# EAGLE design midi-vidi (EAGLE 6.6.0)
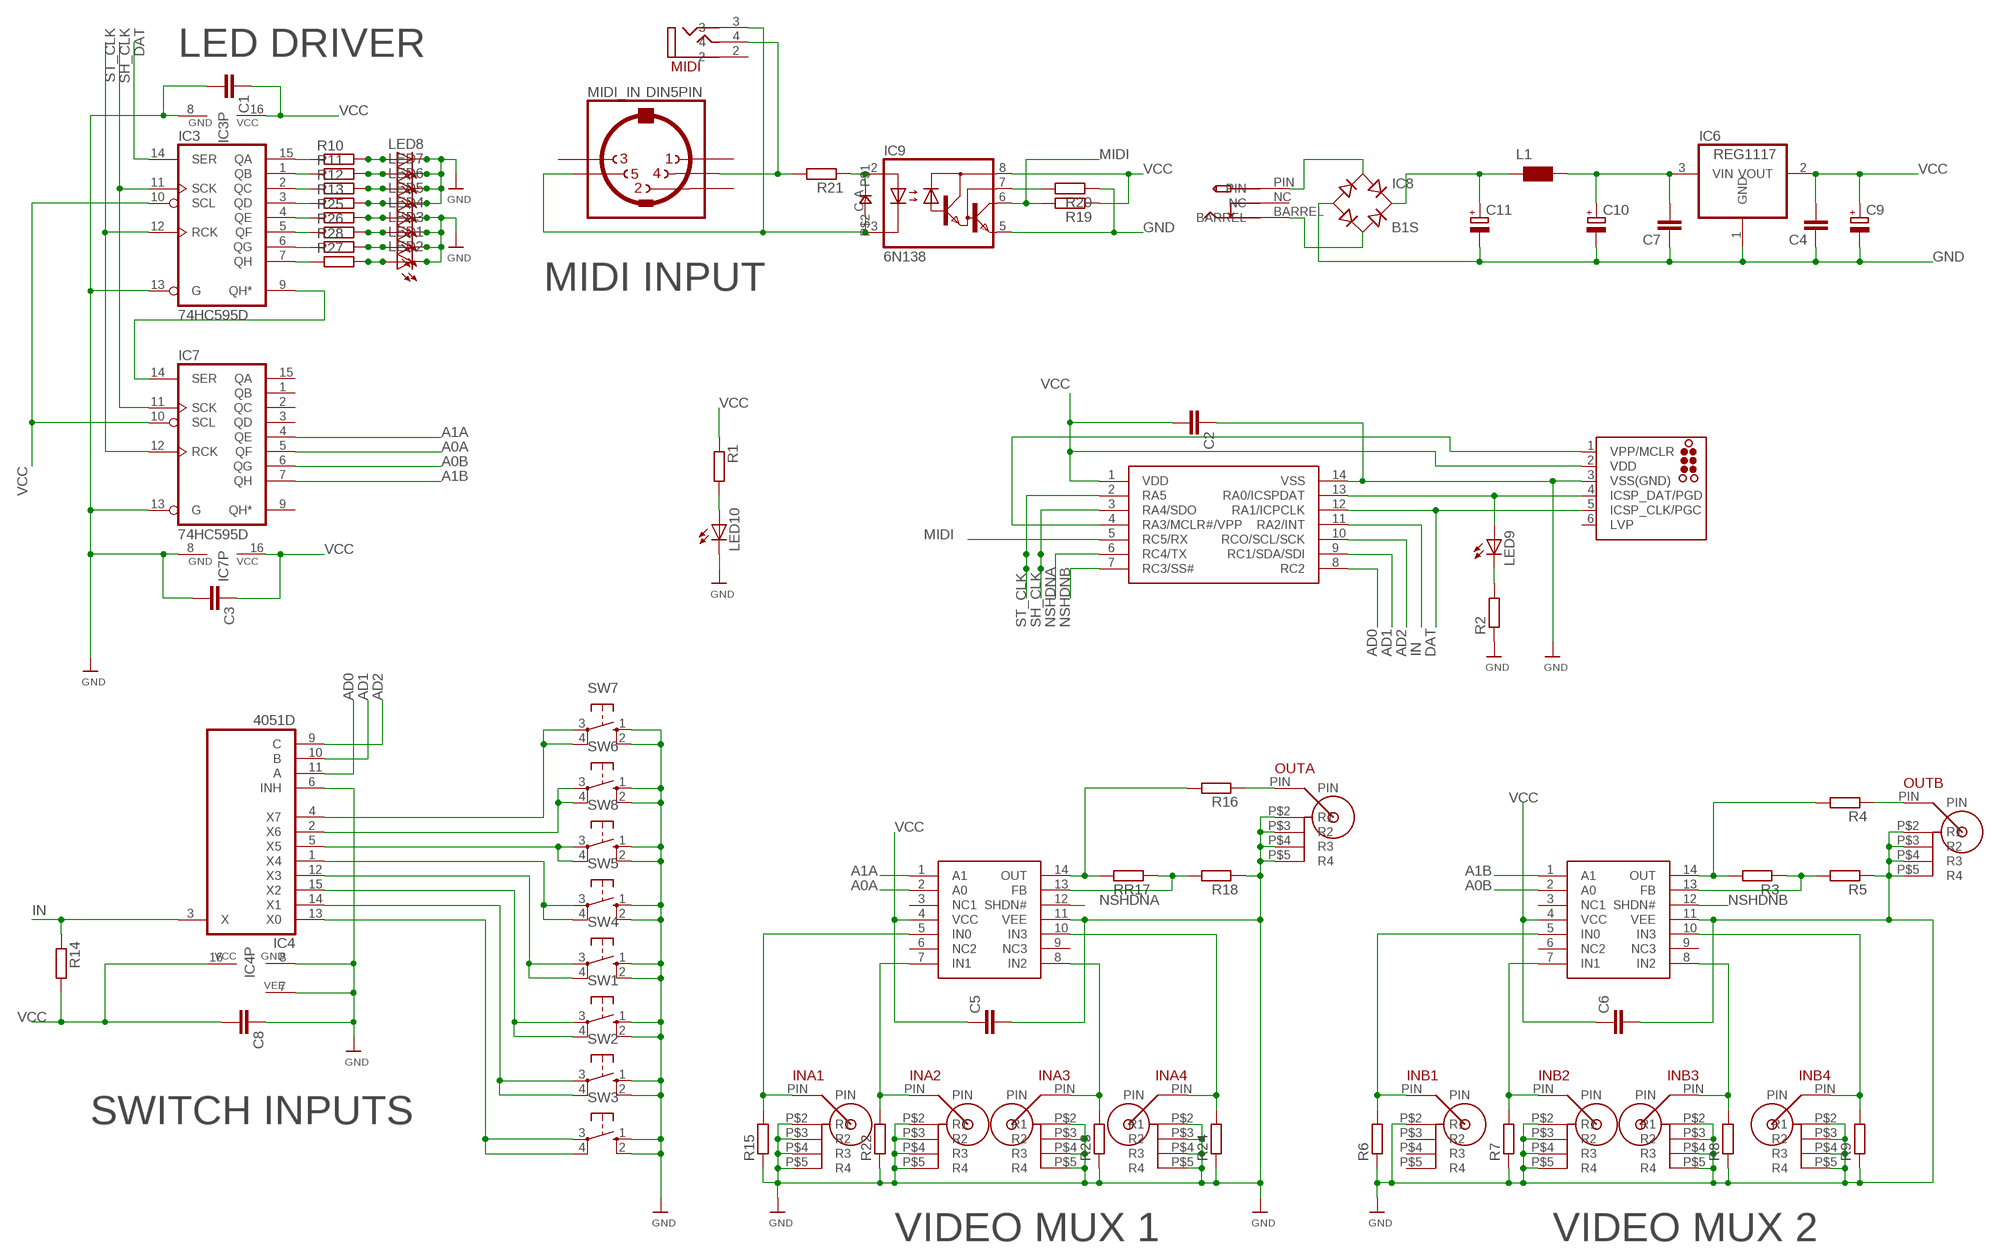
[diagram p0: schematic, sheet 1]

## Parts
C1  C-EUC0805  [C0805]
C2  C-EUC0805  [C0805]
C3  C-EUC0805  [C0805]
C4  C-EUC0805  [C0805]
C5  C-EUC0805  [C0805]
C6  C-EUC0805  [C0805]
C7  C-EUC0805  [C0805]
C8  C-EUC0805  [C0805]
C9  CPOL-EUE2,5-6E  [E2,5-6E]
C10  CPOL-EUE2,5-6E  [E2,5-6E]
C11  CPOL-EUE2,5-6E  [E2,5-6E]
D1  0805DIODE  [0805DIODE]
IC1  MAX4311SO14  [SO14]
IC2  PIC16F1825SO14  [SO14]
IC3  74HC595D  [SO16]
IC4  4051D  [SO16]
IC5  MAX4311SO14  [SO14]
IC6  REG1117  [SOT223]
IC7  74HC595D  [SO16]
IC8  B1S  [MBS]
IC9  6N138  [DIL08]
ICSP  TC2030-MCP-NL  [TC2030-MCP-NL]
INA1  RCAVERT  [RCAVERT]
INA2  RCAVERT  [RCAVERT]
INA3  RCAVERT  [RCAVERT]
INA4  RCAVERT  [RCAVERT]
INB1  RCAVERT  [RCAVERT]
INB2  RCAVERT  [RCAVERT]
INB3  RCAVERT  [RCAVERT]
INB4  RCAVERT  [RCAVERT]
L1  WE-TI_L  [WE-TI_L]
LED1  LED3MM  [LED3MM]
LED2  LED3MM  [LED3MM]
LED3  LED3MM  [LED3MM]
LED4  LED3MM  [LED3MM]
LED5  LED3MM  [LED3MM]
LED6  LED3MM  [LED3MM]
LED7  LED3MM  [LED3MM]
LED8  LED3MM  [LED3MM]
LED9  LED3MM  [LED3MM]
LED10  LED3MM  [LED3MM]
MIDI  VERTICAL_3_5MM_SOCKET  [VERTICAL_3_5MM_SOCKET]
MIDI_IN  DIN5PIN  [EDGEDIN]
OUTA  RCAVERT  [RCAVERT]
OUTB  RCAVERT  [RCAVERT]
R1  R-EU_R0805  [R0805]
R2  R-EU_R0805  [R0805]
R3  R-EU_R0805  [R0805]
R4  R-EU_R0805  [R0805]
R5  R-EU_R0805  [R0805]
R6  R-EU_R0805  [R0805]
R7  R-EU_R0805  [R0805]
R8  R-EU_R0805  [R0805]
R9  R-EU_R0805  [R0805]
R10  R-EU_R0805  [R0805]
R11  R-EU_R0805  [R0805]
R12  R-EU_R0805  [R0805]
R13  R-EU_R0805  [R0805]
R14  R-EU_R0805  [R0805]
R15  R-EU_R0805  [R0805]
R16  R-EU_R0805  [R0805]
R18  R-EU_R0805  [R0805]
R19  R-EU_R0805  [R0805]
R20  R-EU_R0805  [R0805]
R21  R-EU_R0805  [R0805]
R22  R-EU_R0805  [R0805]
R23  R-EU_R0805  [R0805]
R24  R-EU_R0805  [R0805]
R25  R-EU_R0805  [R0805]
R26  R-EU_R0805  [R0805]
R27  R-EU_R0805  [R0805]
R28  R-EU_R0805  [R0805]
RR17  R-EU_R0805  [R0805]
SW1  10-XX  [B3F-10XX]
SW2  10-XX  [B3F-10XX]
SW3  10-XX  [B3F-10XX]
SW4  10-XX  [B3F-10XX]
SW5  10-XX  [B3F-10XX]
SW6  10-XX  [B3F-10XX]
SW7  10-XX  [B3F-10XX]
SW8  10-XX  [B3F-10XX]
U$2  PWR_SOCKET_2_1MM  [PWR_SOCKET_2_1MM]

## Nets
A0A: IC5.2(A0) IC7.5(QF)
A0B: IC1.2(A0) IC7.6(QG)
A1A: IC5.1(A1) IC7.4(QE)
A1B: IC1.1(A1) IC7.7(QH)
AD0: IC2.8(RC2) IC4.11(A)
AD1: IC2.9(RC1/SDA/SDI) IC4.10(B)
AD2: IC2.10(RCO/SCL/SCK) IC4.9(C)
DAT: IC2.12(RA1/ICPCLK) IC3.14(SER) ICSP.5(ICSP_CLK/PGC)
GND: C1.2 C2.1 C3.2 C4.1 C5.2 C6.2 C7.1 C8.1 C9.- C10.- C11.- IC1.11(VEE) IC2.14(VSS) IC3.8(GND) IC3.13(G) IC4.6(INH) IC4.7(VEE) IC4.8(GND) IC5.11(VEE) IC6.1(GND) IC7.8(GND) IC7.13(G) IC8.- IC9.5(GND) ICSP.3(VSS(GND)) INA1.P$2(R1) INA1.P$3(R2) INA1.P$4(R3) INA1.P$5(R4) INA2.P$2(R1) INA2.P$3(R2) INA2.P$4(R3) INA2.P$5(R4) INA3.P$2(R1) INA3.P$3(R2) INA3.P$4(R3) INA3.P$5(R4) INA4.P$2(R1) INA4.P$3(R2) INA4.P$4(R3) INA4.P$5(R4) INB1.P$2(R1) INB2.P$2(R1) INB2.P$3(R2) INB2.P$4(R3) INB2.P$5(R4) INB3.P$2(R1) INB3.P$3(R2) INB3.P$4(R3) INB3.P$5(R4) INB4.P$2(R1) INB4.P$3(R2) INB4.P$4(R3) INB4.P$5(R4) LED1.K(C) LED2.K(C) LED3.K(C) LED4.K(C) LED5.K(C) LED6.K(C) LED7.K(C) LED8.K(C) LED10.K(C) OUTA.P$2(R1) OUTA.P$3(R2) OUTA.P$4(R3) OUTA.P$5(R4) OUTB.P$2(R1) OUTB.P$3(R2) OUTB.P$4(R3) OUTB.P$5(R4) R2.1 R5.1 R6.1 R7.1 R8.1 R9.1 R15.1 R18.1 R20.1 R22.1 R23.1 R24.1 SW1.1(S) SW1.2(S1) SW2.1(S) SW2.2(S1) SW3.1(S) SW3.2(S1) SW4.1(S) SW4.2(S1) SW5.1(S) SW5.2(S1) SW6.1(S) SW6.2(S1) SW7.1(S) SW7.2(S1) SW8.1(S) SW8.2(S1)
IN: IC2.11(RA2/INT) IC4.3(X) R14.1
MIDI: IC2.5(RC5/RX) IC9.6(VO) R19.2
N$1: IC5.10(IN3) INA4.PIN R24.2
N$2: IC5.8(IN2) INA3.PIN R23.2
N$3: IC5.7(IN1) INA2.PIN R22.2
N$4: IC5.5(IN0) INA1.PIN R15.2
N$5: IC5.14(OUT) R16.2 RR17.2
N$6: IC5.13(FB) R18.2 RR17.1
N$7: OUTA.PIN R16.1
N$8: D1.A IC9.2(A) R21.1
N$9: MIDI.4 MIDI_IN.4 R21.2
N$10: IC1.7(IN1) INB2.PIN R7.2
N$11: IC1.8(IN2) INB3.PIN R8.2
N$12: IC1.5(IN0) INB1.PIN R6.2
N$13: IC1.14(OUT) R3.2 R4.2
N$14: IC1.13(FB) R3.1 R5.2
N$15: C7.2 C10.+ IC6.3(VIN) L1.1
N$16: OUTB.PIN R4.1
N$17: IC1.10(IN3) INB4.PIN R9.2
N$18: D1.C IC9.3(C) MIDI.3 MIDI_IN.5
N$19: LED8.A R10.2
N$20: LED7.A R11.2
N$21: LED6.A R12.2
N$22: IC9.7(VB) R20.2
N$23: IC3.15(QA) R10.1
N$24: LED5.A R13.2
N$25: IC3.1(QB) R11.1
N$26: IC3.2(QC) R12.1
N$27: IC3.3(QD) R13.1
N$28: IC3.4(QE) R25.1
N$29: IC3.5(QF) R26.1
N$30: IC3.6(QG) R28.1
N$31: IC3.7(QH) R27.1
N$32: LED4.A R25.2
N$33: LED3.A R26.2
N$34: LED1.A R28.2
N$35: LED2.A R27.2
N$36: LED9.K(C) R2.2
N$37: IC4.4(X7) SW7.3(P) SW7.4(P1)
N$38: IC4.2(X6) SW6.3(P) SW6.4(P1)
N$39: IC4.5(X5) SW8.3(P) SW8.4(P1)
N$40: IC4.1(X4) SW5.3(P) SW5.4(P1)
N$41: IC4.12(X3) SW4.3(P) SW4.4(P1)
N$42: IC4.15(X2) SW1.3(P) SW1.4(P1)
N$43: IC4.14(X1) SW2.3(P) SW2.4(P1)
N$44: IC4.13(X0) SW3.3(P) SW3.4(P1)
N$45: IC2.13(RA0/ICSPDAT) ICSP.4(ICSP_DAT/PGD) LED9.A
N$46: IC8.AC1 U$2.PIN
N$47: IC3.9(QH*) IC7.14(SER)
N$48: IC2.4(RA3/MCLR#/VPP) ICSP.1(VPP/MCLR)
N$49: IC8.AC2 U$2.BARREL
N$50: LED10.A R1.2
N$51: C11.+ IC8.+ L1.2
NSHDNA: IC2.6(RC4/TX) IC5.12(SHDN#)
NSHDNB: IC1.12(SHDN#) IC2.7(RC3/SS#)
SH_CLK: IC2.3(RA4/SDO) IC3.11(SCK) IC7.11(SCK)
ST_CLK: IC2.2(RA5) IC3.12(RCK) IC7.12(RCK)
VCC: C1.1 C2.2 C3.1 C4.2 C5.1 C6.1 C8.2 C9.+ IC1.4(VCC) IC2.1(VDD) IC3.10(SCL) IC3.16(VCC) IC4.16(VCC) IC5.4(VCC) IC6.2(VOUT) IC7.10(SCL) IC7.16(VCC) IC9.8(VCC) ICSP.2(VDD) R1.1 R14.2 R19.1
Unconnected: IC1.3(NC1) IC1.6(NC2) IC1.9(NC3) IC5.3(NC1) IC5.6(NC2) IC5.9(NC3) IC7.1(QB) IC7.2(QC) IC7.3(QD) IC7.9(QH*) IC7.15(QA) ICSP.6(LVP) INB1.P$3(R2) INB1.P$4(R3) INB1.P$5(R4) MIDI.2 MIDI_IN.1 MIDI_IN.2 MIDI_IN.3 U$2.NC

## Notes on the sheet
- LED DRIVER
- MIDI INPUT
- SWITCH INPUTS
- VIDEO MUX 1 | VIDEO MUX 2

## Library data of the parts
C1-C8 = rcl:C-EU: CAPACITOR, European symbol
C9-C11 = rcl:CPOL-EU: POLARIZED CAPACITOR, European symbol
D1 = jasons_stuff:0805DIODE
IC1 IC5 = jason_eagle6:MAX4311
IC2 = jasons_stuff:PIC16F1825
IC3 IC7 = 74xx-eu:74*595: 8-bit SHIFT REGISTER, output latch
IC4 = 40xx:4051: 8-channel ANALOG MULTIPLEXER
IC6 = burr-brown:REG1117: 800mA and 1A Low Dropout (LDO) Positive Regulator 1.8V, 2.5V, 2.85V, 3.3V, 5V, and Adj; MPN: REG1117; OC_FARNELL: 1097566; OC_NEWARK: 14P6981
IC8 = rectifier:B*S: Surface Mount Glass Passivated Bridge Rectifiers Source: Comchip Bridge Rectifiers B05S-G_B10S-G.pdf
IC9 = optocoupler:6N138: MOTOROLA OPTO COUPLER; MF: VISHAY/TELEFUNKEN; MPN: 6N138; OC_FARNELL: 9860150; OC_NEWARK: 35K5294
ICSP = tag-connect:TC2030: TAG-CONNECT ICSP Connector Manufacturer: Tag-Connect <http://www.tag-connect.com> Cable for easy In-Circuit Serial Programming. Designed for Microchip ICD2, suitable for many others. Two variants - one "with legs" (for hands-free fit on PCB) and another "without legs" for quick programming. PAD Description 1 MCLR/Vpp 2 Vdd 3 GND 4 PGD (ISPDAT) 5 PGC (ISPCLK) 6 nc (used for LVP) ©2009 ROFA.cz - modified and updated by Robert Darlington ‹rdarlington@gmail.com›
INA1-INA4 INB1-INB4 OUTA OUTB = jason_eagle6:RCAVERT
L1 = wuerth-elektronik:WE-TI: Radial Leaded Wire Wound Inductor WE-TI A low-cost storage/filtering possibility in comparison to SMD versions - Radial through-hole inductor - High saturation core material -- Signal filtering -- NF-switches
LED1-LED10 = led:LED: LED OSRAM: - CHIPLED LG R971, LG N971, LY N971, LG Q971, LY Q971, LO R971, LY R971 LH N974, LH R974 LS Q976, LO Q976, LY Q976 LO Q996 - Hyper CHIPLED LW Q18S LB Q993, LB Q99A, LB R99A - SideLED LS A670, LO A670, LY A670, LG A670, LP A670 LB A673, LV A673, LT A673, LW A673 LH A674 LY A675 LS A676, LA A676, LO A676, LY A676, LW A676 LS A679, LY A679, LG A679 - Hyper Micro SIDELED® LS Y876, LA Y876, LO Y876, LY Y876 LT Y87S - SmartLED LW L88C, LW L88S LB L89C, LB L89S, LG L890 LS L89K, LO L89K, LY L89K LS L896, LA L896, LO L896, LY L896 - TOPLED LS T670, LO T670, LY T670, LG T670, LP T670 LSG T670, LSP T670, LSY T670, LOP T670, LYG T670 LG T671, LOG T671, LSG T671 LB T673, LV T673, LT T673, LW T673 LH T674 LS T676, LA T676, LO T676, LY T676, LB T676, LH T676, LSB T676, LW T676 LB T67C, LV T67C, LT T67C, LS T67K, LO T67K, LY T67K, LW E67C LS E67B, LA E67B, LO E67B, LY E67B, LB E67C, LV E67C, LT E67C LW T67C LS T679, LY T679, LG T679 LS T770, LO T770, LY T770, LG T770, LP T770 LB T773, LV T773, LT T773, LW T773 LH T774 LS E675, LA E675, LY E675, LS T675 LS T776, LA T776, LO T776, LY T776, LB T776 LHGB T686 LT T68C, LB T68C - Hyper Mini TOPLED® LB M676 - Mini TOPLED Santana® LG M470 LS M47K, LO M47K, LY M47K Source: http://www.osram.convergy.de LUXEON: - LUMILED® LXK2-PW12-R00, LXK2-PW12-S00, LXK2-PW14-U00, LXK2-PW14-V00 LXK2-PM12-R00, LXK2-PM12-S00, LXK2-PM14-U00 LXK2-PE12-Q00, LXK2-PE12-R00, LXK2-PE12-S00, LXK2-PE14-T00, LXK2-PE14-U00 LXK2-PB12-K00, LXK2-PB12-L00, LXK2-PB12-M00, LXK2-PB14-N00, LXK2-PB14-P00, LXK2-PB14-Q00 LXK2-PR12-L00, LXK2-PR12-M00, LXK2-PR14-Q00, LXK2-PR14-R00 LXK2-PD12-Q00, LXK2-PD12-R00, LXK2-PD12-S00 LXK2-PH12-R00, LXK2-PH12-S00 LXK2-PL12-P00, LXK2-PL12-Q00, LXK2-PL12-R00 Source: www.luxeon.com KINGBRIGHT: KA-3528ASYC Source: www.kingbright.com
MIDI = jason_eagle6:VERTICAL_3_5MM_SOCKET
MIDI_IN = jason_eagle6:DIN5PIN: Female CONNECTOR 5 pins 90 deg. with shield, horizontal (DIN 41524)
R1-R16 R18-R28 RR17 = rcl:R-EU_: RESISTOR, European symbol
SW1-SW8 = switch-omron:10-XX: OMRON SWITCH; MPN: B3F-1000; OC_FARNELL: 176432; OC_NEWARK: 36M3542
U$2 = jason_eagle6:PWR_SOCKET_2_1MM

## Board
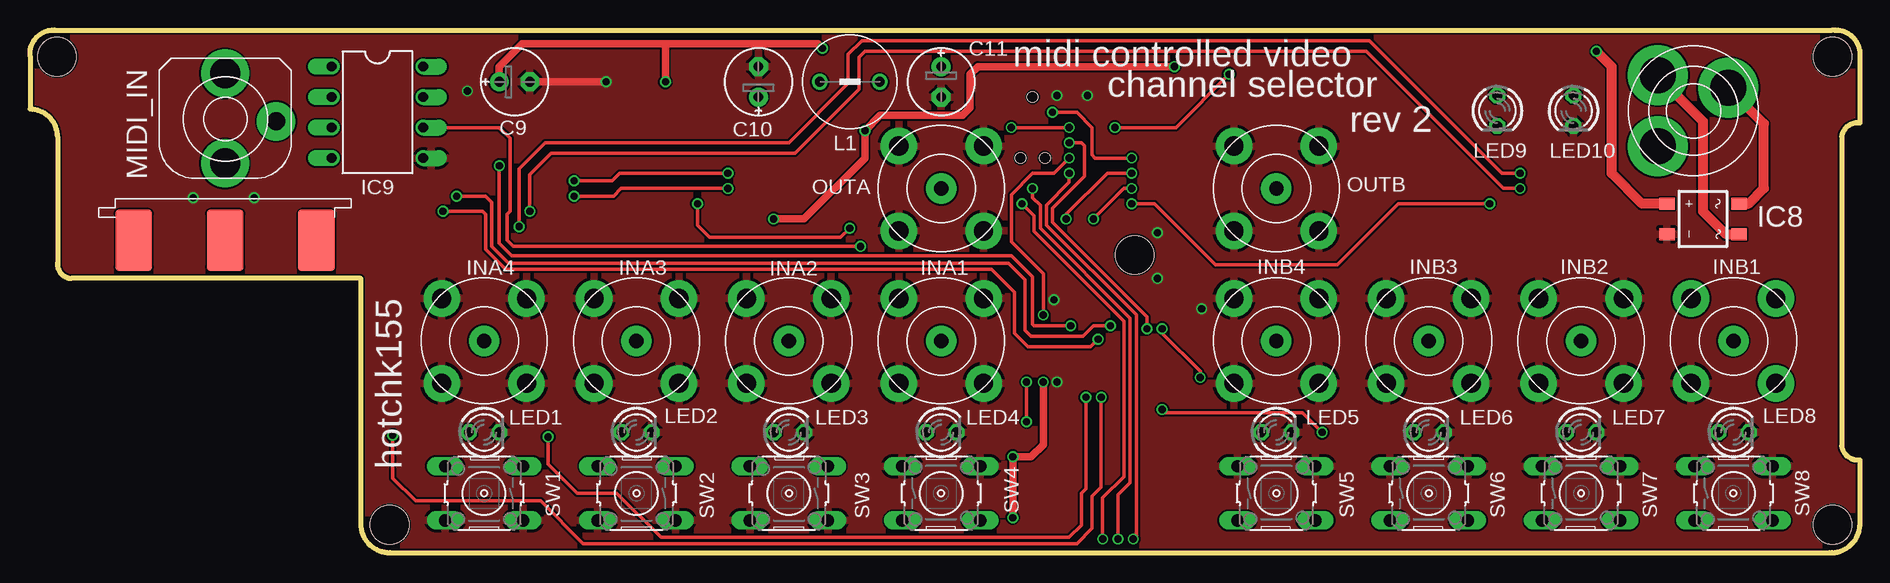
[diagram p1: board, top side]
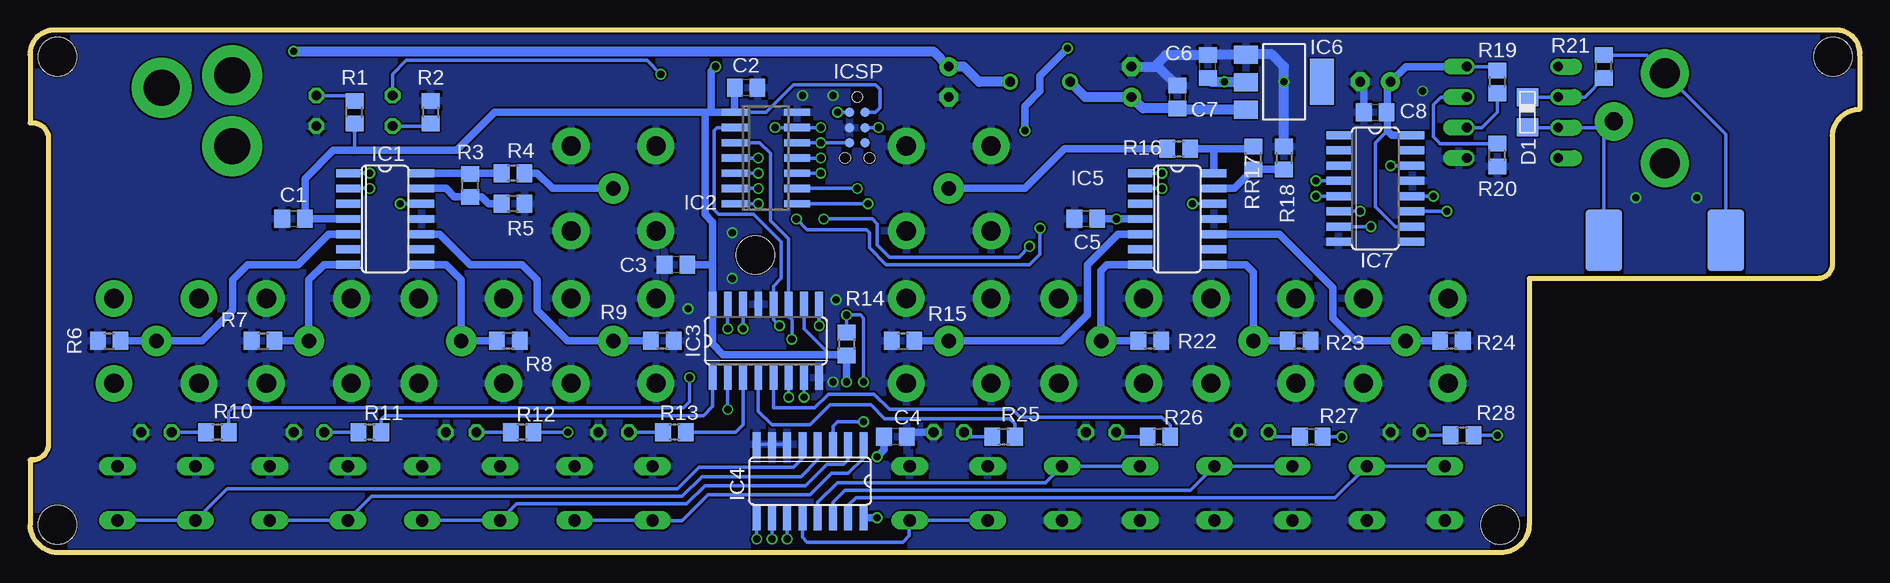
[diagram p2: board, bottom side, seen from below]

Size 152.53 x 43.56 mm. Coordinates in mm from the lower left corner, seen from the top.
Outline: 150.25,43.56 2.04,43.56 arc97 0.01,41.4 0.01,36.96 arc-90 2.29,34.67 2.29,24.13 arc90 3.44,22.86 27.57,22.86 27.57,2.41 arc90 29.98,0 149.99,0 arc90 152.53,2.29 152.53,7.75 arc-90 151.01,8.89 151.01,34.67 arc-90 152.53,35.82 152.53,41.53 arc90 150.5,43.56 150.38,43.56
Copper layers (1*16): Top 0.035mm / dielectric 1.5mm / Bottom 0.035mm
Design rules "hackvana": minimum track width 6mil, minimum drill 0.3mm, track to track 6mil, track to pad 9mil, pad to pad 6mil, via to via 6mil, smd to smd 0mil, copper to edge 6mil, drill to drill 6mil, minimum pad ring 10mil, minimum via ring 6mil, stop-mask expansion 2mil, vias tented up to drill 100mil, thermal gap 10mil
Holes 3.2 mm at 29.98,2.33 150.26,2.33 2.26,41.33 150.26,41.33 92.08,24.82

### Footprints (pad centres in the part's own frame; a part is rotated, then mirrored left to right if it is on the bottom)
C0805 = smd 1.3 x 1.5: 1 -0.95,0; 2 0.95,0
E2,5-6E = drill 0.813 pad 1.575: + -1.27,0 | drill 0.813 pad 1.575 octagon: - 1.27,0
0805DIODE = smd 1.524 x 1.778: A -1.262,-0.005; C 1.238,-0.005
SO14 = smd 0.66 x 2.032: 1 -3.81,-3.073; 2 -2.54,-3.073; 3 -1.27,-3.073; 4 0,-3.073; 5 1.27,-3.073; 6 2.54,-3.073; 7 3.81,-3.073; 8 3.81,3.073; 9 2.54,3.073; 10 1.27,3.073; 11 0,3.073; 12 -1.27,3.073; 13 -2.54,3.073; 14 -3.81,3.073
SO14' = smd 0.6 x 2.2: 1 -3.81,-2.6; 2 -2.54,-2.6; 3 -1.27,-2.6; 4 0,-2.6; 5 1.27,-2.6; 6 2.54,-2.6; 7 3.81,-2.6; 8 3.81,2.6; 9 2.54,2.6; 10 1.27,2.6; 11 0,2.6; 12 -1.27,2.6; 13 -2.54,2.6; 14 -3.81,2.6
SO16 = smd 0.66 x 2.032: 1 -4.445,-3.073; 2 -3.175,-3.073; 3 -1.905,-3.073; 4 -0.635,-3.073; 5 0.635,-3.073; 6 1.905,-3.073; 7 3.175,-3.073; 8 4.445,-3.073; 9 4.445,3.073; 10 3.175,3.073; 11 1.905,3.073; 12 0.635,3.073; 13 -0.635,3.073; 14 -1.905,3.073; 15 -3.175,3.073; 16 -4.445,3.073
SOT223 = smd 1.499 x 2.007: 1 -2.261,-3.15; 2 0.025,-3.15; 3 2.311,-3.15 | smd 3.81 x 2.007: 4 0,3.15
MBS = smd 1 x 1.3: + -1.27,-3; - 1.27,-3; AC1 -1.27,3; AC2 1.27,3
DIL08 = drill 0.813 offset: 1 -3.81,-3.81; 2 -1.27,-3.81; 3 1.27,-3.81; 4 3.81,-3.81; 5 3.81,3.81; 6 1.27,3.81; 7 -1.27,3.81; 8 -3.81,3.81
TC2030-MCP-NL = smd 0.787 x 0.787: 1 1.27,-0.635; 2 1.27,0.635; 3 2.54,-0.635; 4 2.54,0.635; 5 3.81,-0.635; 6 3.81,0.635 | hole 0.889: 0,0; 5.08,-1.016; 5.08,1.016
RCAVERT = drill 1.6 pad 3.048: P$2 -5,0; P$3 5,0; P$4 0,5; P$5 0,-5 | drill 1.2 pad 2.54: PIN 0,0
WE-TI_L = drill 0.813: 1 -2.5,0; 2 2.5,0
LED3MM = drill 0.813 octagon: A -1.27,0; K 1.27,0
VERTICAL_3_5MM_SOCKET = drill 2.5 pad 4: 2 0,-3.75; 4 0,3.75 | drill 1.5 pad 3.2: 3 4.25,-0.25
EDGEDIN = smd 3.048 x 5.08: 1 -7.62,-10.16; 2 0,-10.16; 3 7.62,-10.16 | smd 3.048 x 5.08 bottom: 4 -5.08,-10.16; 5 5.08,-10.16
R0805 = smd 1.3 x 1.5: 1 -0.95,0; 2 0.95,0
B3F-10XX = drill 1.016 long: 1 -3.251,2.261; 2 3.251,2.261; 3 -3.251,-2.261; 4 3.251,-2.261
PWR_SOCKET_2_1MM = drill 3 pad 5: BARREL 0,4.2; NC -4.2,0; PIN 3.4,-0.7

### Placement (x,y rotation side)
C1  130.56,27.81 180 bottom
C2  92.84,38.74 180 bottom
C3  98.69,24 180 bottom
C4  80.4,9.65 180 bottom
C5  64.52,27.81 180 bottom
C6  54.36,40.51 90 bottom
C7  56.9,37.97 270 bottom
C8  40.39,36.7 0 bottom
C9  40.39,39.24 0 top
C10  60.71,39.24 90 top
C11  75.95,39.24 270 top
D1  27.69,36.7 270 bottom
IC1  122.94,27.81 270 bottom
IC2  PIC16F1825SO14  [SO14']  91.19,32.89 270 bottom
IC3  91.19,17.65 0 bottom
IC4  87.51,5.97 180 bottom
IC5  56.9,27.81 270 bottom
IC6  48.01,39.24 270 bottom
IC7  40.39,30.35 270 bottom
IC8  139.45,27.81 270 top
IC9  28.96,36.7 270 top
ICSP  83.57,37.97 270 bottom
INA1  75.95,17.65 45 top
INA2  63.25,17.65 45 top
INA3  50.55,17.65 45 top
INA4  37.85,17.65 45 top
INB1  141.99,17.65 45 top
INB2  129.29,17.65 45 top
INB3  116.59,17.65 45 top
INB4  103.89,17.65 45 top
L1  68.33,39.24 0 top
LED1  37.85,10.03 0 top
LED2  50.55,10.03 0 top
LED3  63.25,10.03 0 top
LED4  75.95,10.03 0 top
LED5  103.89,10.03 0 top
LED6  116.59,10.03 0 top
LED7  129.29,10.03 0 top
LED8  141.99,10.03 0 top
LED9  122.31,36.83 270 top
LED10  128.66,36.83 270 top
MIDI  16.26,36.2 0 top
MIDI_IN  16.26,36.2 0 top
OUTA  75.95,30.35 45 top
OUTB  103.89,30.35 45 top
R1  125.48,36.7 90 bottom
R2  119.13,36.7 270 bottom
R3  115.83,30.61 90 bottom
R4  112.28,31.62 180 bottom
R5  112.28,29.08 180 bottom
R6  145.93,17.65 0 bottom
R7  133.1,17.65 0 bottom
R8  112.66,17.65 180 bottom
R9  99.83,17.65 180 bottom
R10  136.91,10.03 180 bottom
R11  124.21,10.03 180 bottom
R12  111.51,10.03 180 bottom
R13  98.81,10.03 180 bottom
R14  84.46,17.4 270 bottom
R15  79.76,17.65 0 bottom
R16  56.78,33.66 0 bottom
R18  48.01,32.89 270 bottom
R19  30.23,39.24 270 bottom
R20  30.23,33.15 90 bottom
R21  21.34,40.51 90 bottom
R22  59.19,17.65 180 bottom
R23  46.74,17.65 180 bottom
R24  34.04,17.65 180 bottom
R25  71.38,9.65 180 bottom
R26  58.43,9.65 180 bottom
R27  45.73,9.65 180 bottom
R28  33.15,9.78 180 bottom
RR17  50.55,32.89 90 bottom
SW1  37.85,4.95 180 top
SW2  50.55,4.95 180 top
SW3  63.25,4.95 180 top
SW4  75.95,4.95 0 top
SW5  103.89,4.95 0 top
SW6  116.59,4.95 0 top
SW7  129.29,4.95 0 top
SW8  141.99,4.95 0 top
U$2  138.66,36.83 45 top

### Tracks (layer width: path | path; a pad name or v marks a point on that pad's centre or on a via)
A0A  (via drill 0.6)
  Top 0.305: v45.35,29.72 48.65,29.72 49.28,30.35 v58.17,30.35
  Bottom 0.305: IC7.5 v45.35,29.72 | v58.17,30.35 IC5.2
A0B  (via drill 0.6)
  Top 0.305: v124.21,30.35 122.82,30.35 111.39,41.78 69.6,41.78 69.1,41.28 69.1,38.61 63.76,33.28 43.44,33.28 41.66,31.5 v41.66,28.45
  Bottom 0.305: IC7.6 v41.66,28.45 | 126.75,30.35 IC1.2 v124.21,30.35
A1A  (via drill 0.6)
  Top 0.305: v45.35,30.99 48.52,30.99 49.16,31.62 v58.17,31.62
  Bottom 0.305: IC7.4 v45.35,30.99 | v58.17,31.62 IC5.1
A1B  (via drill 0.6)
  Top 0.305: v124.21,31.62 122.69,31.62 111.64,42.67 69.35,42.67 68.21,41.53 68.21,39.12 63.25,34.16 42.93,34.16 40.77,32.01 v40.77,27.18
  Bottom 0.305: IC1.1 v124.21,31.62 | v40.77,27.18 IC7.7
AD0  (via drill 0.6)
  Top 0.305: v89.42,1.14 89.42,4.57 91.19,6.35 91.19,19.31 83.7,26.8 83.7,28.07 v82.68,29.08
  Bottom 0.305: IC4.11 v89.42,1.14 | IC2.8 v82.68,29.08
AD1  (via drill 0.6)
  Top 0.305: v90.69,1.14 90.69,4.83 91.7,5.84 91.7,19.56 84.21,27.05 84.21,28.96 83.57,29.59 v83.57,30.35
  Bottom 0.305: IC4.10 v90.69,1.14 | IC2.9 v83.57,30.35
AD2  (via drill 0.6)
  Top 0.305: v86.62,31.62 86.62,30.86 84.72,28.96 84.72,27.31 92.21,19.81 92.21,1.4 v91.96,1.14
  Bottom 0.305: IC4.9 v91.96,1.14 | IC2.10 v86.62,31.62
DAT  (via drill 0.6)
  Top 0.305: v86.62,34.16 87.64,34.16 87.89,33.91 87.89,31.37 85.22,28.7 85.22,27.56 93.1,19.69 v93.1,18.67
  Bottom 0.305: ICSP.5 v86.62,34.16 IC2.12 | IC3.14 v93.1,18.67
GND  (via drill 0.6)
  Top 0.61: C9.- v48.01,39.24
  Bottom 0.305: IC4.8 IC4.7 IC4.6
  Bottom 0.61: LED4.K 79.07,10.03 C4.1 | C8.1 41.34,38.92 C9.-
  Bottom 0.813: C10.- 58.81,40.51 | 58.81,40.51 58.49,40.51 C7.1 | 58.81,40.51 57.86,41.46 C6.2 54.32,41.51 IC6.1 51.14,41.53 49.03,41.53 48.01,40.51 v48.01,39.24 R18.1
  other vias: 13.6,29.59 18.68,29.59 36.46,38.48 97.67,20.32 93.99,22.86 85.61,14.23 85.61,38.1 88.15,38.1 85.35,21.08 93.99,26.67
  pour Bottom: -4.06,45.59 -4.06,-2.67 157.23,-2.67 157.23,48.13 -4.06,48.13
  pour Top: -2.79,46.86 -2.79,-3.94 155.96,-3.94 155.96,48.13 -2.79,48.13
IN  (via drill 0.6)
  Top 0.305: v84.46,19.81 84.46,23.24 81.8,25.91 81.8,29.85 83.57,31.62 85.35,31.62 v86.62,32.89 | v83.07,10.92 v83.07,14.23
  Bottom 0.305: IC2.11 v86.62,32.89 | R14.1 v84.46,19.81 83.32,19.81 83.07,19.56 v83.07,14.23 | IC4.3 85.61,10.54 85.22,10.92 v83.07,10.92
MIDI  (via drill 0.6)
  Top 0.305: v91.83,31.62 89.8,31.62 86.37,28.2 v86.37,27.81 | IC9.6 39.12,35.43 40.01,34.55 40.01,28.45 39.76,28.2 39.76,26.04 40.27,25.53 v69.22,25.53
  Bottom 0.305: IC2.5 v91.83,31.62 | v69.22,25.53 70.11,24.64 80.91,24.64 81.92,25.66 81.92,27.43 82.3,27.81 v86.37,27.81 | IC9.6 31.5,35.43 30.23,36.7 R19.2
N$1
  Bottom 0.61: R24.2 INA4.PIN 42.04,17.65 43.95,19.56 43.95,22.1 48.39,26.54 IC5.10
N$2
  Bottom 0.61: IC5.8 51.19,24 50.55,23.37 INA3.PIN R23.2
N$3
  Bottom 0.61: IC5.7 62.75,24 63.25,23.5 INA2.PIN R22.2
N$4
  Bottom 0.61: R15.2 INA1.PIN 66.56,17.65 64.4,19.81 64.4,24 61.86,26.54 IC5.5
N$5
  Bottom 0.61: R16.2 53.86,33.66 | 53.86,33.66 50.74,33.66 RR17.2 | IC5.14 53.83,33.63 53.86,33.66
N$6
  Bottom 0.61: R18.2 RR17.1 52.14,30.35 IC5.13
N$7
  Bottom 0.61: R16.1 66.3,33.66 69.6,30.35 OUTA.PIN
N$8
  Bottom 0.305: R21.1 22.93,37.97 IC9.2 27.69,37.97 D1.A
N$9
  Bottom 0.305: MIDI_IN.4 11.18,34.87 MIDI.4 17.78,41.46 R21.2
N$10
  Bottom 0.61: IC1.7 128.02,24 129.29,22.73 INB2.PIN R7.2
N$11
  Bottom 0.61: IC1.8 117.86,24 116.59,22.73 INB3.PIN R8.2
N$12
  Bottom 0.61: IC1.5 127.64,26.54 130.18,24 134.37,24 135.64,22.73 135.64,20.19 138.18,17.65 INB1.PIN R6.2
N$13
  Bottom 0.61: IC1.14 115.9,31.62 R3.2 115.77,31.62 R4.2
N$14
  Bottom 0.61: IC1.13 117.86,30.35 117.17,29.66 R3.1 114.88,29.66 114.31,29.08 R5.2
N$15
  Bottom 0.813: L1.1 64.56,37.97 C10.+ 59.76,37.02 C7.2 56.81,36.93 IC6.3
N$16
  Bottom 0.61: OUTB.PIN 108.97,30.35 110.24,31.62 R4.1
N$17
  Bottom 0.61: IC1.10 118.37,26.54 115.83,24 111.51,24 110.24,22.73 110.24,20.19 107.7,17.65 INB4.PIN R9.2
N$18
  Bottom 0.305: D1.C 27.67,35.43 IC9.3 21.03,35.43 MIDI.3 21.34,35.12 MIDI_IN.5
N$19
  Bottom 0.305: R10.2 LED8.A
N$20
  Bottom 0.305: R11.2 LED7.A
N$21
  Bottom 0.305: R12.2 LED6.A
N$22
  Bottom 0.305: IC9.7 34.93,37.97 35.57,37.34 35.57,34.67 35.19,34.29 35.06,34.16 34.99,34.1 R20.2
N$23  (via drill 0.6)
  Top 0.305: v94.37,18.67 94.37,18.29 97.54,15.11 v97.54,14.61
  Bottom 0.305: R10.1 135.96,11.75 135.64,12.07 98.05,12.07 97.54,12.57 v97.54,14.61 | IC3.15 v94.37,18.67
N$24
  Bottom 0.305: R13.2 LED5.A
N$25
  Bottom 0.305: R11.1 123.26,11.11 122.94,11.43 98.81,11.43 97.8,11.43 96.4,11.43 95.64,12.19 IC3.1
N$26  (via drill 0.6)
  Top 0.305: v107.7,10.03 106.05,11.69 94.62,11.69 v94.37,11.94
  Bottom 0.305: R12.1 v107.7,10.03 | v94.37,11.94 IC3.2
N$27
  Bottom 0.305: IC3.3 93.1,10.67 93.73,10.03 R13.1
N$28
  Bottom 0.305: R25.1 70.43,10.74 70.87,11.18 81.29,11.18 82.43,12.32 85.86,12.32 87.51,10.67 90.69,10.67 91.83,11.81 IC3.4
N$29
  Bottom 0.305: R26.1 57.48,10.61 58.17,11.3 69.98,11.3 70.62,11.94 80.91,11.94 82.18,13.21 85.99,13.21 87.13,12.07 90.56,12.07 IC3.5
N$30  (via drill 0.6)
  Top 0.305: v89.29,12.96 89.29,5.46 88.53,4.7 88.53,2.03 87.26,0.76 46.11,0.76 42.55,4.32 32.14,4.32 30.23,6.22 v30.23,9.78
  Bottom 0.305: IC3.6 v89.29,12.96 | v30.23,9.78 R28.1
N$31  (via drill 0.6)
  Top 0.305: v88.02,12.96 88.02,5.34 87.64,4.95 87.64,2.29 86.62,1.27 52.59,1.27 48.9,4.95 45.6,4.95 43.19,7.37 v43.19,9.65
  Bottom 0.305: IC3.7 v88.02,12.96 | v43.19,9.65 R27.1
N$32
  Bottom 0.305: R25.2 74.3,9.65 LED4.A
N$33
  Bottom 0.305: R26.2 61.6,9.65 LED3.A
N$34
  Bottom 0.305: R28.2 36.33,9.78 LED1.A
N$35
  Bottom 0.305: R27.2 48.9,9.65 LED2.A
N$36
  Bottom 0.305: LED9.K 119.33,35.56 R2.2
N$37
  Bottom 0.305: IC4.4 86.88,7.75 88.27,6.35 96.53,6.35 98.18,4.7 124.04,4.7 SW7.3 SW7.4
N$38
  Bottom 0.305: IC4.2 84.34,7.75 84.72,7.37 86.11,7.37 87.89,5.59 96.27,5.59 97.8,4.07 111.97,4.07 SW6.3 SW6.4
N$39
  Bottom 0.305: IC4.5 88.15,7.88 88.91,7.11 96.78,7.11 98.56,5.34 136.1,5.34 SW8.3 SW8.4
N$40
  Bottom 0.305: SW5.3 99.17,2.69 | IC4.1 83.07,7.88 84.34,6.61 85.73,6.61 87.51,4.83 96.02,4.83 98.18,2.67 100.62,2.67 SW5.3 | SW5.3 SW5.4
N$41
  Bottom 0.305: IC4.12 88.15,1.27 87.76,0.89 79.76,0.89 79.26,1.4 79.26,2.64 SW4.4 SW4.3
N$42
  Bottom 0.305: IC4.15 84.34,3.94 83.7,4.57 43.75,4.57 SW1.3 SW1.4
N$43
  Bottom 0.305: IC4.14 85.61,4.19 84.59,5.21 55.81,5.21 SW2.3 SW2.4
N$44
  Bottom 0.305: IC4.13 86.88,4.19 85.22,5.84 67.88,5.84 SW3.3 SW3.4
N$45  (via drill 0.6)
  Top 0.305: v86.62,35.43 v81.8,35.43 | v99.96,39.88 95.51,35.43 v90.43,35.43
  Bottom 0.305: v86.62,35.43 IC2.13 v90.43,35.43 | v81.8,35.43 ICSP.4 | LED9.A 122.31,39.88 121.17,41.02 101.1,41.02 v99.96,39.88
N$46
  Top 0.813: IC8.AC1 143.26,29.08 144.53,30.35 144.53,35.76 U$2.PIN
N$47  (via drill 0.6)
  Top 0.305: v86.75,18.92 83.7,18.92 83.57,19.05 83.57,22.99 81.8,24.77 40.14,24.77 39.12,25.78 v39.12,32.26
  Bottom 0.305: IC7.14 v39.12,32.26 | v86.75,18.92 IC3.9
N$48  (via drill 0.6)
  Top 0.305: v85.22,36.7 87.26,36.7 88.53,35.43 88.53,33.15 88.78,32.89 v91.83,32.89
  Bottom 0.305: ICSP.1 v85.22,36.7 | v91.83,32.89 IC2.4
N$49
  Top 0.813: U$2.BARREL 135.69,39.71 139.45,35.94 139.45,28.45 141.36,26.54 IC8.AC2
N$50
  Bottom 0.305: LED10.A 125.93,38.1 R1.2
N$51  (via drill 0.6)
  Top 0.813: IC8.+ 134.37,29.08 131.83,31.62 131.83,40.51 v130.56,41.78
  Bottom 0.813: v130.56,41.78 77.22,41.78 C11.+ 74.68,40.51 73.41,39.24 L1.2
NSHDNA  (via drill 0.6)
  Top 0.305: v91.83,30.35 91.19,30.35 v88.65,27.81 | v55.63,29.08 55.63,27.31 56.65,26.29 67.57,26.29 v68.33,27.05
  Bottom 0.305: IC2.6 v91.83,30.35 | v55.63,29.08 IC5.12 | v68.33,27.05 68.33,24.89 69.22,24 81.16,24 82.56,25.4 82.56,26.67 82.81,26.93 87.76,26.93 v88.65,27.81
NSHDNB  (via drill 0.6)
  Top 0.305: v91.83,29.08 93.73,29.08 98.81,24 108.97,24 114.05,29.08 v121.67,29.08
  Bottom 0.305: IC2.7 v91.83,29.08 | v121.67,29.08 IC1.12 119.13,29.08
SH_CLK  (via drill 0.6)
  Top 0.305: v34.42,28.45 37.73,28.45 37.98,28.2 37.98,25.27 39.63,23.62 80.14,23.62 82.05,21.72 82.05,18.29 83.19,17.15 88.4,17.15 v89.03,17.78
  Bottom 0.305: IC7.11 v34.42,28.45 | IC2.3 91.7,34.16 90.81,33.28 90.81,27.69 89.29,26.16 IC3.11 89.29,19.69 89.03,19.43 v89.03,17.78
ST_CLK  (via drill 0.6)
  Top 0.305: v35.57,29.72 37.98,29.72 38.49,29.21 38.49,25.53 39.89,24.13 81.54,24.13 82.94,22.73 82.94,18.54 83.45,18.04 87.76,18.04 88.65,18.92 v90.05,18.92
  Bottom 0.305: IC7.12 v35.57,29.72 | IC2.2 95.26,35.43 95.51,35.18 95.51,28.58 95.13,28.2 92.21,28.2 89.92,25.91 89.92,22.86 90.56,22.23 IC3.12 90.56,19.43 v90.05,18.92
VCC  (via drill 0.6)
  Top 0.61: v95.38,40.51 79,40.51 78.37,39.88 78.37,37.09 77.73,36.45 70.87,36.45 v69.6,35.18 69.6,32.89 64.52,27.81 v61.98,27.81 | v81.92,2.92 v81.92,8 83.45,8 84.46,9.02 v84.46,14.23 | C9.+ 39.12,40.51 41.03,42.42 53.09,42.42 | 53.09,42.42 65.67,42.42 v66.05,42.04 | v52.97,39.24 52.97,42.29 53.09,42.42
  Bottom 0.305: 39,36.26 C8.2 | 39.38,35.18 40.39,34.16 40.39,28.83 38.74,27.18 IC7.10 | IC9.8 30.55,40.51 R19.1 | ICSP.2 82.05,36.7 81.67,37.09 81.67,38.61 82.05,38.99 88.91,38.99 91.19,36.7 IC2.1 | 125.48,35.31 125.48,33.53 | 84.84,16.38 84.78,16.45 R14.2 84.9,16.89 | IC3.10 88.02,18.67 85.86,16.51
  Bottom 0.61: IC1.4 C1.1 129.61,31.18 127.26,33.53 125.48,33.53 116.97,33.53 113.8,36.7 96.4,36.7 | R1.1 125.48,35.31 | 95.77,36.7 IC2.1 C2.2 | 95.77,36.7 96.4,36.7 | 39.38,36.77 39.38,38.99 C9.+ 37.85,40.51 IC9.8 | 39.38,36.77 C8.2 | IC7.16 39,34.8 39.38,35.18 39.38,36.77 | C5.1 v61.98,27.81 IC5.4 | IC4.16 81.95,2.9 v81.92,2.92 | v84.46,14.23 R14.2 84.52,16.51 85.86,16.51 94.75,16.51 95.64,17.4 IC3.16 95.64,24 | C4.2 81.35,8.58 v81.92,8 | 95.77,36.7 95.77,40.13 v95.38,40.51 | v69.6,35.18 69.6,37.21 68.33,38.48 68.33,39.75 v66.05,42.04 | 95.64,24 95.64,27.56 96.27,28.2 96.27,36.58 96.4,36.7 | C3.1 95.64,24
  Bottom 0.813: C6.1 54.02,39.22 IC6.2 52.94,39.22 v52.97,39.24

### Text on the board
tNames: midi controlled video | channel selector | rev 2 | hotchk155